# Altium project Arduino Uno.PrjPcb (part 1 of 3)
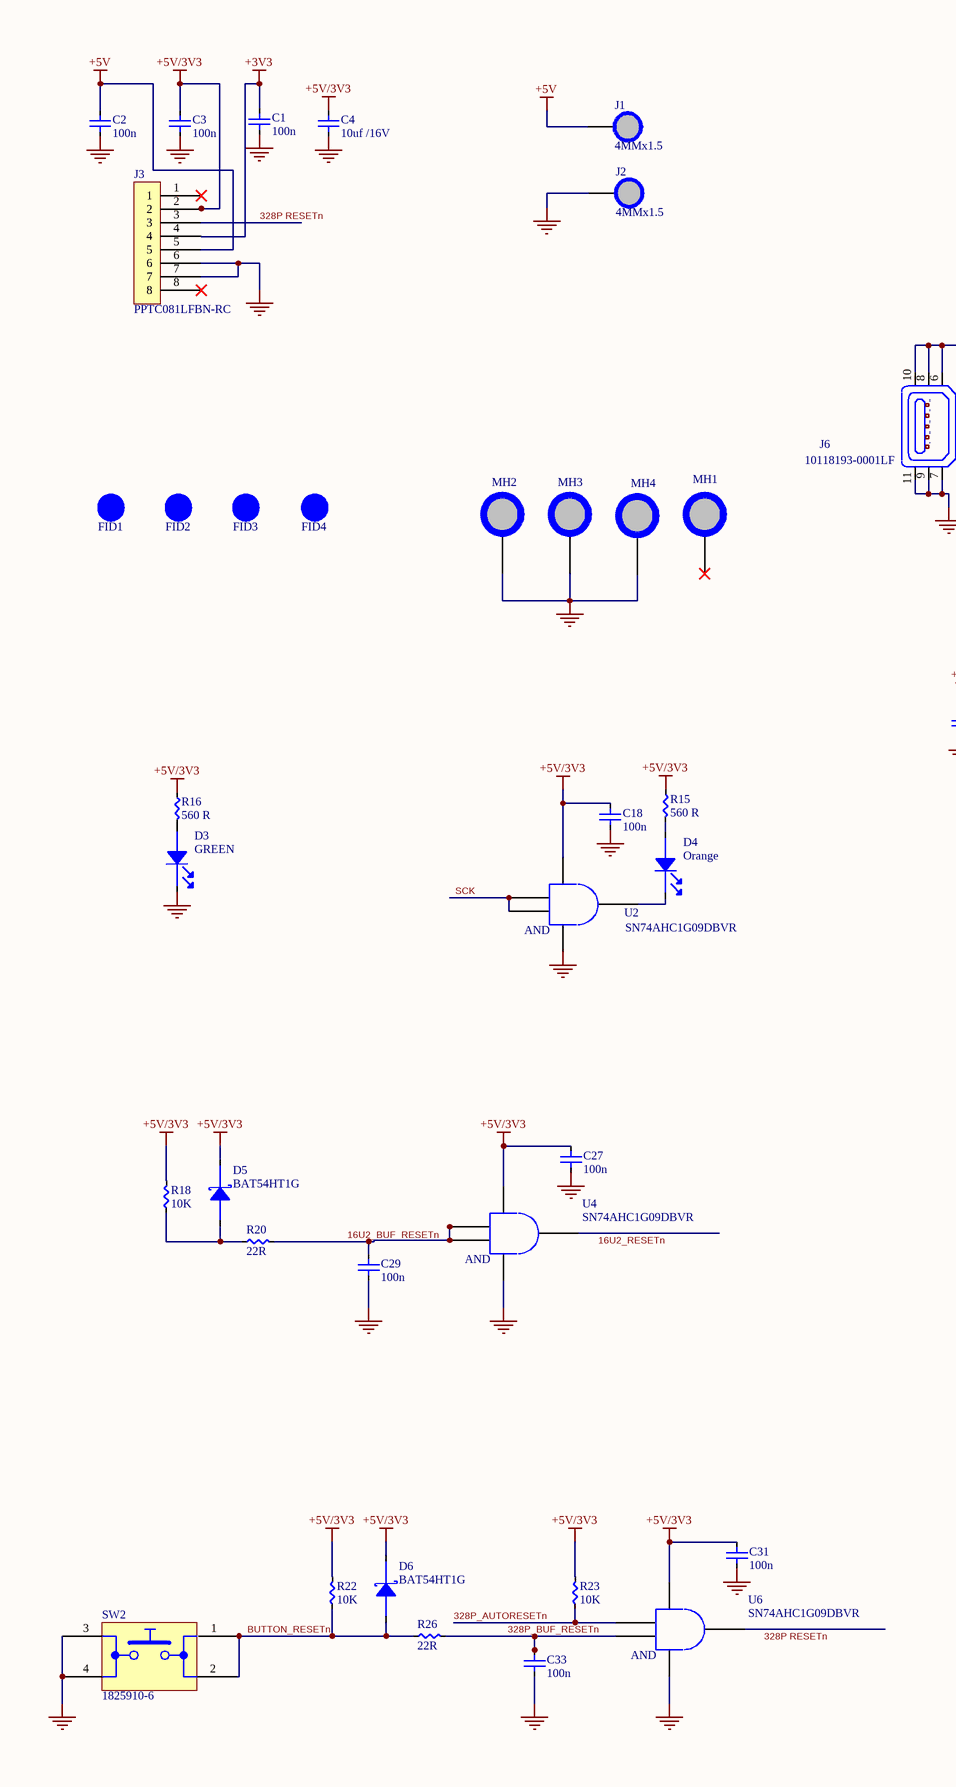
[diagram p0: Arduino_UNO_schematic.SchDoc, left]
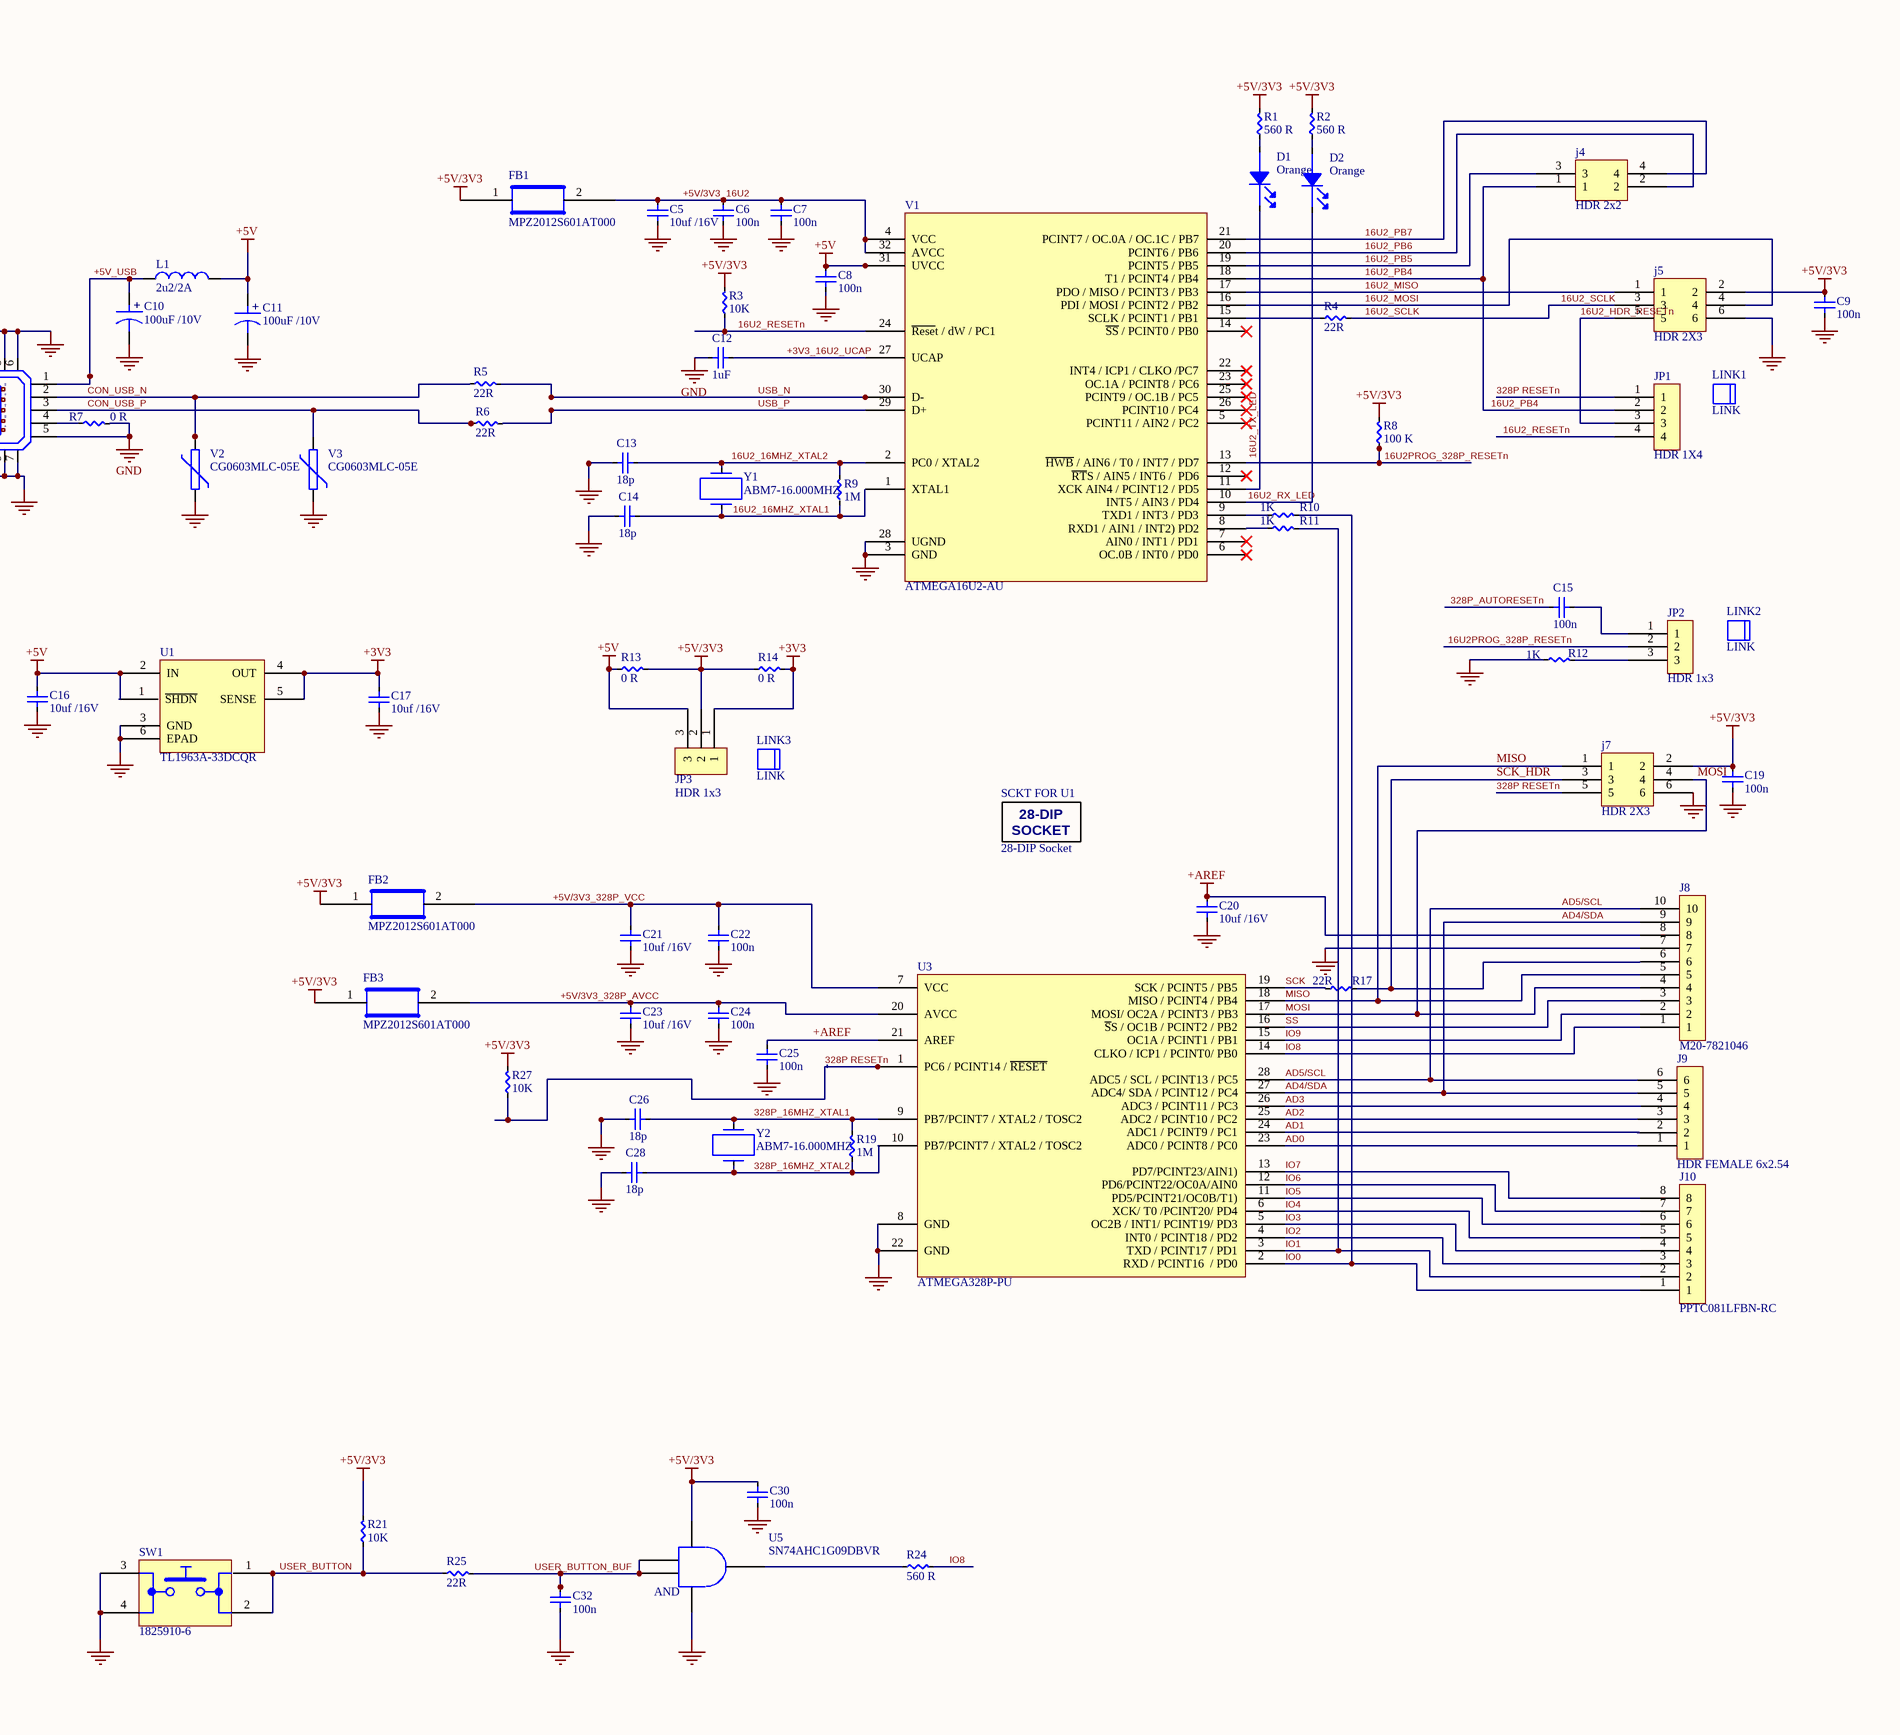
[diagram p1: Arduino_UNO_schematic.SchDoc, right]
NotFitted: NF
1 sheet, 108 parts. Net scope: global (net labels, ports and power ports of the same name join across sheets).
Board file: Arduino_UNO_ver_1.PcbDoc

## Sheet Arduino_UNO_schematic.SchDoc
size A2

### Parts
C1  100n  [C805]
C2  100n  [C805]
C3  100n  [C805]
C4  10uf /16V  [C805-10Uf]
C5  10uf /16V  [C805-10Uf]
C6  100n  [C805]
C7  100n  [C805]
C8  100n  [C805]
C9  100n  [C805]
C10  100uF /10V  [C_ALUMI_100]
C11  100uF /10V  [C_ALUMI_100]
C12  1uF  [C805]
C13  18p  [C805]
C14  18p  [C805]
C15  100n  [C805]
C16  10uf /16V  [C805-10Uf]
C17  10uf /16V  [C805-10Uf]
C18  100n  [C805]
C19  100n  [C805]
C20  10uf /16V  [C805-10Uf]
C21  10uf /16V  [C805-10Uf]
C22  100n  [C805]
C23  10uf /16V  [C805-10Uf]
C24  100n  [C805]
C25  100n  [C805]
C26  18p  [C805]
C27  100n  [C805]
C28  18p  [C805]
C29  100n  [C805]
C30  100n  [C805]
C31  100n  [C805]
C32  100n  [C805]
C33  100n  [C805]
D1  Orange  [LED_0603]
D2  Orange  [LED_0603]
D3  GREEN  [LED_0603]
D4  Orange  [LED_0603]
D5  BAT54HT1G  [SO-232]
D6  BAT54HT1G  [SO-232]
FB1  MPZ2012S601AT000  [C805]
FB2  MPZ2012S601AT000  [C805]
FB3  MPZ2012S601AT000  [C805]
FID1  FID_1MMC  [FID_40x120D]  (value not drawn)  (no BOM)
FID2  FID_1MMC  [FID_40x120D]  (value not drawn)  (no BOM)
FID3  FID_1MMC  [FID_40x120D]  (value not drawn)  (no BOM)
FID4  FID_1MMC  [FID_40x120D]  (value not drawn)  (no BOM)
J1  4MMx1.5  [PAD_WITH_HOLE_1.44MM]  (no BOM)
J2  4MMx1.5  [PAD_WITH_HOLE_1.44MM]  (no BOM)
J3  PPTC081LFBN-RC  [HDR FEMALE 8x2.54]
j4  HDR 2x2  [HDR 2x2_2.54mm]
j5  HDR 2X3  [HDR 2x3]
J6  10118193-0001LF  [10118193]
j7  HDR 2X3  [HDR 2x3]
J8  M20-7821046  [HDR FEMALE 10x2.54]
J9  HDR FEMALE 6x2.54  [HDR FEMALE 6x2.54]
J10  PPTC081LFBN-RC  [HDR FEMALE 8x2.54]
JP1  HDR 1X4  [HDR MALE 1X4_2.54]
JP2  HDR 1x3  [HDR_1x3x2.54]
JP3  HDR 1x3  [HDR_1x3x2.54]
L1  2u2/2A  [C1210_IND]
LINK1  LINK  (mechanical)
LINK2  LINK  (mechanical)
LINK3  LINK  (mechanical)
MH1  MH_7.4MMNC_3.2MMD  [MH_7.4MMD_3.2MM_NO_COPPER_NPTH]  (value not drawn)  (no BOM)
MH2  MH_7.4MMC_3.2MMd  [MH_7.4MMD_3.2MMD]  (value not drawn)  (no BOM)
MH3  MH_7.4MMC_3.2MMd  [MH_7.4MMD_3.2MMD]  (value not drawn)  (no BOM)
MH4  MH_7.4MMC_3.2MMd  [MH_7.4MMD_3.2MMD]  (value not drawn)  (no BOM)
R1  560 R  [R0805]
R2  560 R  [R0805]
R3  10K  [R0805]
R4  22R  [R0805]
R5  22R  [R0805]
R6  22R  [R0805]
R7  0 R  [R0805]
R8  100 K  [R0805]
R9  1M  [R0805]
R10  1K  [R0805]
R11  1K  [R0805]
R12  1K  [R0805]
R13  0 R  [R0805]
R14  0 R  [R0805]
R15  560 R  [R0805]
R16  560 R  [R0805]
R17  22R  [R0805]
R18  10K  [R0805]
R19  1M  [R0805]
R20  22R  [R0805]
R21  10K  [R0805]
R22  10K  [R0805]
R23  10K  [R0805]
R24  560 R  [R0805]
R25  22R  [R0805]
R26  22R  [R0805]
R27  10K  [R0805]
SCKT_FOR_U1  28-DIP Socket  [28_DIP_7.62mm_SOCKET]
SW1  1825910-6  [1825910-6]
SW2  1825910-6  [1825910-6]
U1  TL1963A-33DCQR  [DCQ(R-PDSO-G6)]
U2  SN74AHC1G09DBVR  [DVB_SOT_23_5]
U3  ATMEGA328P-PU  [28_ATMEGA328P-PU]
U4  SN74AHC1G09DBVR  [DVB_SOT_23_5]
U5  SN74AHC1G09DBVR  [DVB_SOT_23_5]
U6  SN74AHC1G09DBVR  [DVB_SOT_23_5]
V1  ATMEGA16U2-AU  [TQFP_32_ATMEGA16U2]
V2  CG0603MLC-05E  [R0603]
V3  CG0603MLC-05E  [R0603]
Y1  ABM7-16.000MHZ  [ABM7_v1_1_Big]
Y2  ABM7-16.000MHZ  [ABM7_v1_1_Big]

### Nets
+3V3: C1.2 C17.2 J3.4 JP3.1 R14.2 U1.4(OUT) U1.5(SENSE)
+5V: C2.2 C8.2 C11.1 C16.2 J1.1 J3.5 JP3.3 L1.2 R13.1 U1.1(~{SHDN}) U1.2(IN) V1.31(UVCC)
+5V/3V3: C3.2 C4.2 C9.2 C18.2 C19.2 C27.2 C30.2 C31.2 D5.1(Cathode) D6.1(Cathode) FB1.1 FB2.1 FB3.1 J3.2 j5.2 j7.2 JP3.2 R1.2 R2.2 R3.2 R8.2 R13.2 R14.1 R15.1 R16.1 R18.2 R21.2 R22.2 R23.2 R27.2 U2.5 U4.5 U5.5 U6.5
+AREF: C20.2 C25.2 J8.8 U3.21(AREF)
GND: C1.1 C2.1 C3.1 C4.1 C5.1 C6.1 C7.1 C8.1 C9.1 C10.2 C11.2 C12.1 C13.1 C14.1 C16.1 C17.1 C18.1 C19.1 C20.1 C21.1 C22.1 C23.1 C24.1 C25.1 C26.1 C27.1 C28.1 C29.1 C30.1 C31.1 C32.1 C33.1 D3.1(Cathode) J2.1 J3.6 J3.7 j5.6 J6.5 J6.6 J6.7 J6.8 J6.9 J6.10 J6.11 j7.6 J8.7 MH2.1 MH3.1 MH4.1 R7.2 R12.1 SW1.3 SW1.4 SW2.3 SW2.4 U1.3(GND) U1.6(EPAD) U2.3 U3.8(GND) U3.22(GND) U4.3 U5.3 U6.3 V1.3(GND) V1.28(UGND) V2.1 V3.1
16U2_16MHZ_XTAL1: C14.2 R9.1 V1.1(XTAL1) Y1.1
16U2_16MHZ_XTAL2: C13.2 R9.2 V1.2(PC0_/_XTAL2) Y1.2
16U2_BUF_RESETn: C29.2 R20.2 U4.1 U4.2
16U2_HDR_RESETn: j5.5 JP1.3
16U2_MISO: j5.1 V1.17(PDO_/_MISO_/_PCINT3_/_PB3)
16U2_MOSI: j5.4 V1.16(PDI_/_MOSI_/_PCINT2_/_PB2)
16U2_PB4: j4.1 JP1.2 V1.18(T1_/_PCINT4_/_PB4)
16U2_PB5: j4.3 V1.19(PCINT5_/_PB5)
16U2_PB6: j4.2 V1.20(PCINT6_/_PB6)
16U2_PB7: j4.4 V1.21(PCINT7_/_OC.0A_/_OC.1C_/_PB7)
16U2_RESETn: JP1.4 R3.1 U4.4 V1.24(~{Rese}t_/_dW_/_PC1)
16U2_RX_LED: D2.1(Cathode) V1.10(INT5_/_AIN3_/_PD4)
16U2_SCLK: j5.3 R4.2
16U2_TX_LED: D1.1(Cathode) V1.11(XCK_AIN4_/_PCINT12_/_PD5)
16U2PROG_328P_RESETn: JP2.2 R8.1 V1.13(~{HWB}_/_AIN6_/_T0_/_INT7_/_PD7)
328P RESETn: J3.3 j7.5 JP1.1 R27.1 U3.1(PC6_/_PCINT14_/_~{RESET}) U6.4
328P_16MHZ_XTAL1: C26.2 R19.2 U3.9(PB7/PCINT7_/_XTAL2_/_TOSC2) Y2.2
328P_16MHZ_XTAL2: C28.2 R19.1 U3.10(PB7/PCINT7_/_XTAL2_/_TOSC2) Y2.1
328P_AUTORESETn: C15.1 R23.1 U6.1
328P_BUF_RESETn: C33.2 R26.2 U6.2
+3V3_16U2_UCAP: C12.2 V1.27(UCAP)
+5V/3V3_16U2: C5.2 C6.2 C7.2 FB1.2 V1.4(VCC) V1.32(AVCC)
+5V/3V3_328P_AVCC: C23.2 C24.2 FB3.2 U3.20(AVCC)
+5V/3V3_328P_VCC: C21.2 C22.2 FB2.2 U3.7(VCC)
+5V_USB: C10.1 J6.1 L1.1
AD0: J9.1 U3.23(ADC0_/_PCINT8_/_PC0)
AD1: J9.2 U3.24(ADC1_/_PCINT9_/_PC1)
AD2: J9.3 U3.25(ADC2_/_PCINT10_/_PC2)
AD3: J9.4 U3.26(ADC3_/_PCINT11_/_PC3)
AD4/SDA: J8.9 J9.5 U3.27(ADC4/_SDA_/_PCINT12_/_PC4)
AD5/SCL: J8.10 J9.6 U3.28(ADC5_/_SCL_/_PCINT13_/_PC5)
BUTTON_RESETn: D6.2(Anode) R22.1 R26.1 SW2.1 SW2.2
CON_USB_N: J6.2 R5.1 V2.2
CON_USB_P: J6.3 R6.1 V3.2
IO0: J10.1 R10.2 U3.2(RXD_/_PCINT16__/_PD0)
IO1: J10.2 R11.2 U3.3(TXD_/_PCINT17_/_PD1)
IO2: J10.3 U3.4(INT0_/_PCINT18_/_PD2)
IO3: J10.4 U3.5(OC2B_/_INT1/_PCINT19/_PD3)
IO4: J10.5 U3.6(XCK/_T0_/PCINT20/_PD4)
IO5: J10.6 U3.11(PD5/PCINT21/OC0B/T1))
IO6: J10.7 U3.12(PD6/PCINT22/OC0A/AIN0)
IO7: J10.8 U3.13(PD7/PCINT23/AIN1))
IO8: J8.1 R24.2 U3.14(CLKO_/_ICP1_/_PCINT0/_PB0)
IO9: J8.2 U3.15(OC1A_/_PCINT1_/_PB1)
MISO: j7.1 J8.5 U3.18(MISO_/_PCINT4_/_PB4)
MOSI: j7.4 J8.4 U3.17(MOSI/_OC2A_/_PCINT3_/_PB3)
SCK: R17.1 U2.1 U2.2 U3.19(SCK_/_PCINT5_/_PB5)
SCK_HDR: j7.3 J8.6 R17.2
SS: J8.3 U3.16(~{S}S_/_OC1B_/_PCINT2_/_PB2)
USB_N: R5.2 V1.30(D-)
USB_P: R6.2 V1.29(D+)
USER_BUTTON: R21.1 R25.1 SW1.1 SW1.2
USER_BUTTON_BUF: C32.2 R25.2 U5.1 U5.2
NetC15_2: C15.2 JP2.1
NetD1_2: D1.2(Anode) R1.1
NetD2_2: D2.2(Anode) R2.1
NetD3_2: D3.2(Anode) R16.2
NetD4_1: D4.1(Cathode) U2.4
NetD4_2: D4.2(Anode) R15.2
NetD5_2: D5.2(Anode) R18.1 R20.1
NetJ6_4: J6.4 R7.1
NetJP2_3: JP2.3 R12.2
NetR4_1: R4.1 V1.15(SCLK_/_PCINT1_/_PB1)
NetR10_1: R10.1 V1.9(TXD1_/_INT3_/_PD3)
NetR11_1: R11.1 V1.8(RXD1_/_AIN1_/_INT2)_PD2)
NetR24_1: R24.1 U5.4

Not connected (* = marked no-connect by the designer): J3 1* 8*; MH1 1*; V1 5(PCINT11_/_AIN2_/_PC2)* 6(OC.0B_/_INT0_/_PD0)* 7(AIN0_/_INT1_/_PD1)* 12(~{RT}S_/_AIN5_/_INT6_/__PD6)* 14(~{SS}_/_PCINT0_/_PB0)* 22(INT4_/_ICP1_/_CLKO_/PC7)* 23(OC.1A_/_PCINT8_/_PC6)* 25(PCINT9_/_OC.1B_/_PC5)* 26(PCINT10_/_PC4)*